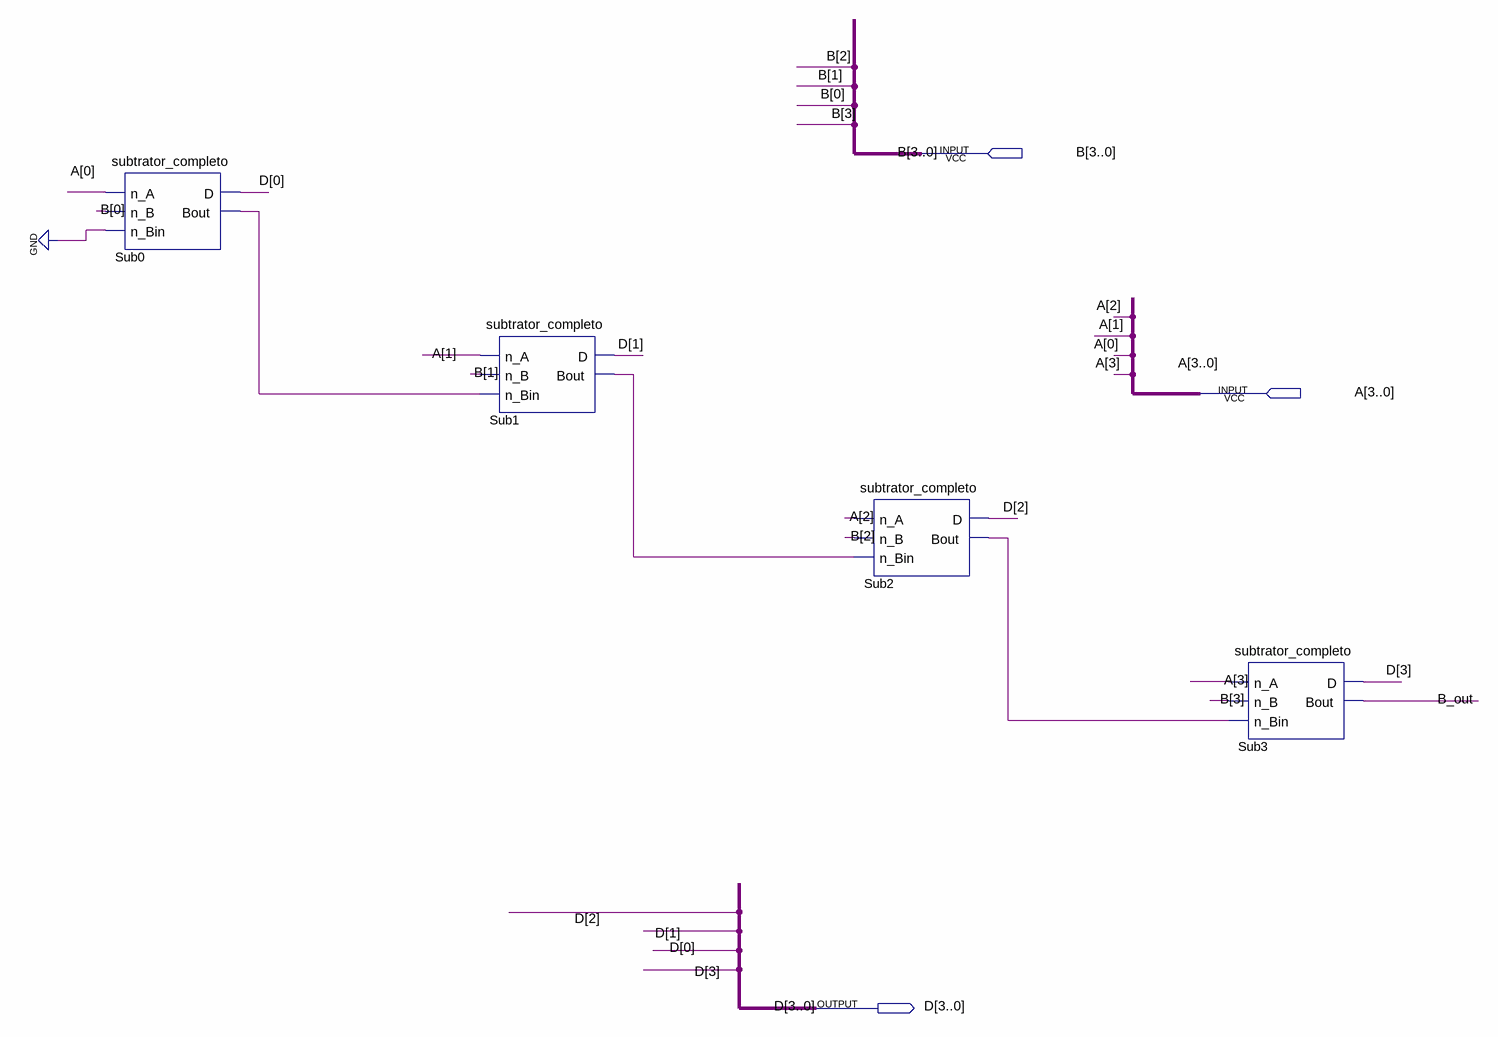
[diagram p0: schematic sheet]
// Quartus schematic subtrator4semdisplay.bdf as structural Verilog: 4 symbols, 3 pins
module subtrator4semdisplay (
  input  [3:0] B,
  input  [3:0] A,
  output [3:0] D
);

  wire B_out, Sub0_bout, Sub1_bout, Sub2_bout;

  subtrator_completo Sub0 (.n_A(A[0]), .n_B(B[0]), .n_Bin(1'b0), .D(D[0]), .Bout(Sub0_bout));
  subtrator_completo Sub1 (.n_A(A[1]), .n_B(B[1]), .n_Bin(Sub0_bout), .D(D[1]), .Bout(Sub1_bout));
  subtrator_completo Sub2 (.n_A(A[2]), .n_B(B[2]), .n_Bin(Sub1_bout), .D(D[2]), .Bout(Sub2_bout));
  subtrator_completo Sub3 (.n_A(A[3]), .n_B(B[3]), .n_Bin(Sub2_bout), .D(D[3]), .Bout(B_out));
endmodule
